# EasyEDA Pro project 起跑检测.epro

# Schematic Schematic1
Board Name: Board1; Create Date: 2025-03-22; Page Name: P1; Project Name: （等待焊接）起跑检测（螺丝孔扩大）; Schematic Name: Schematic1; Update Date: 2025-04-04; Company: 嘉立创EDA; Page Size: A4; Version: V1.0
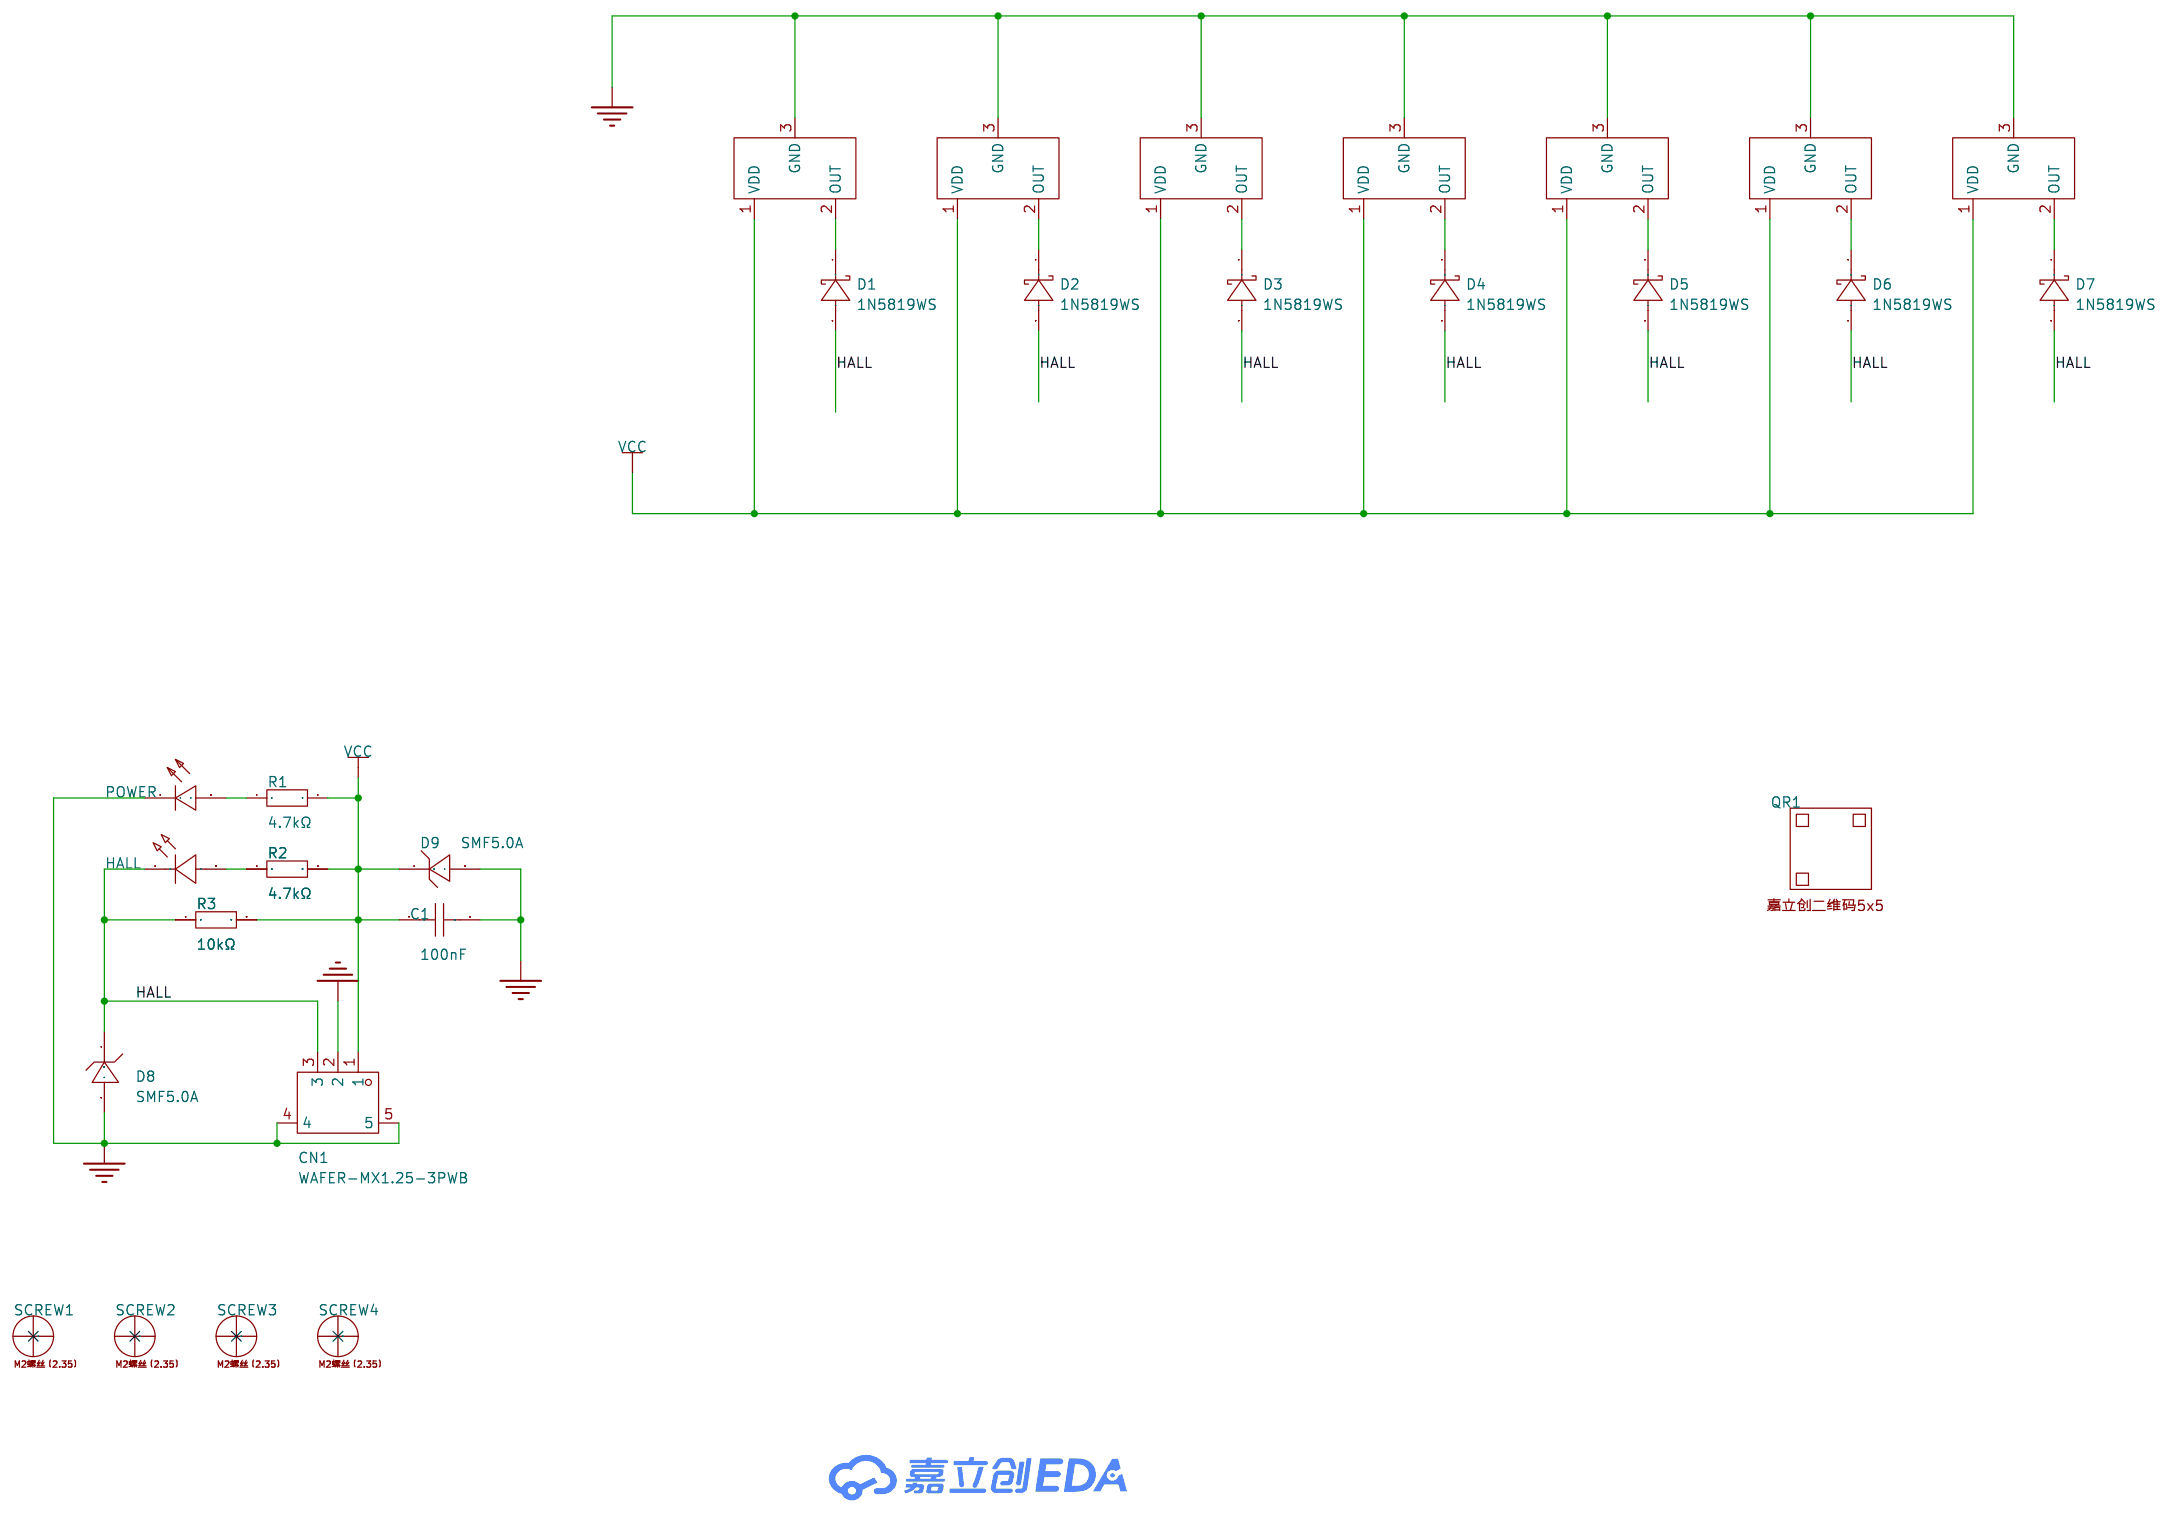
[diagram p0: schematic sheet]

## Parts
C1  100nF  [C0805]
CN1  WAFER-MX1.25-3PWB  [CONN-SMD_3P-P1.25_WAFER-MX1.25-3PWB]
D1  1N5819WS  [SOD-323_L1.6-W1.3-LS2.6-RD-1]
D2  1N5819WS  [SOD-323_L1.6-W1.3-LS2.6-RD-1]
D3  1N5819WS  [SOD-323_L1.6-W1.3-LS2.6-RD-1]
D4  1N5819WS  [SOD-323_L1.6-W1.3-LS2.6-RD-1]
D5  1N5819WS  [SOD-323_L1.6-W1.3-LS2.6-RD-1]
D6  1N5819WS  [SOD-323_L1.6-W1.3-LS2.6-RD-1]
D7  1N5819WS  [SOD-323_L1.6-W1.3-LS2.6-RD-1]
D8  SMF5.0A  [SOD-123FL_L2.7-W1.8-LS3.8-RD]
D9  SMF5.0A  [SOD-123FL_L2.7-W1.8-LS3.8-RD]
HALL  XL-2012SYGC  [LED0805-RD_GREEN]
POWER  NCD0603R1  [LED0603-RD_RED]
QR1  -  [JLC-QRCODE-5x5]
R1  4.7kΩ  [R0805]
R2  4.7kΩ  [R0805]
R3  10kΩ  [R0805]
SCREW1  -  [M2螺丝（2.35）]
SCREW2  -  [M2螺丝（2.35）]
SCREW3  -  [M2螺丝（2.35）]
SCREW4  -  [M2螺丝（2.35）]
U1  -  [SOT-23_L2.9-W1.3-P0.95-LS2.4-TL]
U2  -  [SOT-23_L2.9-W1.3-P0.95-LS2.4-TL]
U3  -  [SOT-23_L2.9-W1.3-P0.95-LS2.4-TL]
U4  -  [SOT-23_L2.9-W1.3-P0.95-LS2.4-TL]
U5  -  [SOT-23_L2.9-W1.3-P0.95-LS2.4-TL]
U6  -  [SOT-23_L2.9-W1.3-P0.95-LS2.4-TL]
U7  -  [SOT-23_L2.9-W1.3-P0.95-LS2.4-TL]

## Library data of the parts
C1 = CC0805KRX7R9BB104: 容值:100nF;精度:±10%;额定电压:50V;材质(温度系数):X7R;; LCSC Part Name: 100nF ±10% 50V; Supplier Part: C49678; Manufacturer: YAGEO(国巨); Supplier Footprint: 0805; JLCPCB Part Class: Basic Part; Datasheet: https://atta.szlcsc.com/upload/public/pdf/source/20180224/C181747_15194369449651363981.pdf; Supplier: LCSC; Tolerance: ±10%; Voltage Rated: 50V; Temperature Coefficient: X7R
CN1 = WAFER-MX1.25-3PWB: 插针结构:1x3P;间距:1.25mm;安装方式:卧贴;参考系列:PicoBlade(MX 1.25);总PIN数:3P;排数:1;每排PIN数:3;行距:-;额定电流:1A;触头材质:黄铜;触头镀层:-;工作温度:-25℃~+85℃;; LCSC Part Name: 1x3P 间距:1.25mm 卧贴 系列:PicoBlade(MX 1.25); Supplier Part: C3029360; Manufacturer: XUNPU(讯普); Supplier Footprint: SMD,P=1.25mm,卧贴; JLCPCB Part Class: 扩展库; Datasheet: https://atta.szlcsc.com/upload/public/pdf/source/20220527/5ACBB683E384B6AD06743F272F933620.pdf; Supplier: LCSC; Pins Structure: 1x3P; Pitch: 1.25mm; Mounting Type: 卧贴; Reference Series: PicoBlade(MX 1.25); Number of Pins: 3P; Number of Rows: 1; Number of PINs Per Row: 3; Current Rating: 1A; Contact Material: 黄铜; Operating Temperature: -25℃~+85℃; Voltage Rating: 125V; Plastic Material: LCP; Supplementary Features: 辅助焊脚; Color: 米色; Z-Height of the Board: 3.6mm; X-Length of Bottom Edge on Board (Spacing Line): 8.75mm; Y-Width of Bottom Edge on Board: 5.25mm
D1-D7 = 1N5819WS: 正向压降(Vf):580mV@1A;直流反向耐压(Vr):40V;整流电流:1A;; LCSC Part Name: 电压:40V 电流:1A; Supplier Part: C2903903; Manufacturer: GOODWORK(固得沃克); Supplier Footprint: SOD-323; JLCPCB Part Class: Extended Part; Datasheet: https://atta.szlcsc.com/upload/public/pdf/source/20220114/BF6ECC8ED918A91A4FEA6F25B6F03A5F.pdf; Supplier: LCSC; Forward Voltage (Vf@If): 580mV@1A; Reverse Voltage (Vr): 40V; Rectified Current: 1A; Reverse Leakage Current (Ir): 50uA@40V
D8 D9 = SMF5.0A_C193402: 反向截止电压(Vrwm):5V;最大钳位电压:9.2V;峰值脉冲电流(Ipp)@10/1000us:21.7A;击穿电压:6.4V;; LCSC Part Name: 单向TVS 5V截止 21.7A峰值脉冲; Supplier Part: C193402; Manufacturer: MDD; Supplier Footprint: SOD-123FL; JLCPCB Part Class: Extended Part; Datasheet: https://atta.szlcsc.com/upload/public/pdf/source/20230823/46DC63B2A09D9D06F4FC5ACC8B9FF97C.pdf; Supplier: LCSC; Reverse Stand-Off Voltage (Vrwm): 5V; Maximum Clamping Voltage: 9.2V; Peak Pulse Current (Ipp)@10/1000us: 21.7A; Breakdown Voltage: 6.4V; Type: TVS
HALL = XL-2012SYGC: 发光颜色:黄绿色;正向电压(VF):2.3V;功率:50mW;正向电流:20mA;主波长:565nm~575nm;透镜颜色:无色透明透镜;色温:-;发光强度:215mcd;发光角度:120°;载带方式:正贴;工作温度:-20℃~+85℃;; Supplier Part: C965816; Manufacturer: XINGLIGHT(成兴光); Supplier Footprint: 0805; JLCPCB Part Class: 扩展库; Datasheet: https://atta.szlcsc.com/upload/public/pdf/source/20240218/33A7A1C9B7559875425299FF3D6B2704.pdf; Supplier: LCSC; Emitted Color: 黄绿色; Forward Voltage (VF): 2.3V; Power Dissipation: 50mW; Forward Current: 20mA; Dominant Wavelength: 565nm~575nm; Peak Wavelength: 570nm; Lens Color: 无色透明透镜; Luminous Intensity: 215mcd; Viewing Angle: 120°; Mounting Sytle: 正贴; Operating Temperature: -20℃~+85℃
POWER = NCD0603R1_C84263: 灯头类型:-;发光颜色:红色;正向压降(Vf):1.6V~2.6V;功率:65mW;正向电流:25mA;波长:615nm~630nm;二极管配置:独立二极管;透镜颜色:-;色温:-;发光强度:80mcd~220mcd;发光角度:130°;载带方式:-;工作温度:-30℃~+85℃;; Supplier Part: C84263; Manufacturer: 国星光电; Supplier Footprint: 0603; JLCPCB Part Class: Extended Part; Datasheet: https://atta.szlcsc.com/upload/public/pdf/source/20200820/C84263_DABC6A75E58F576973B407FDBA283D60.pdf; Supplier: LCSC; Illumination Color: 红色; Voltage - Forward(Vf): 1.6V~2.6V; Power(Watts): 65mW; Forward Current: 25mA; Wavelength - Dominant: 615nm~630nm; Diode Configuration: 独立二极管; Luminous Intensity: 80mcd~220mcd; Viewing Angle: 130°; Operating Temperature: -30℃~+85℃
QR1 = 嘉立创二维码5x5: Check: false
R1 R2 = 0805W8F4701T5E: 电阻类型:厚膜电阻;阻值:4.7kΩ;精度:±1%;功率:125mW;最大工作电压:150V;温度系数:±100ppm/℃;; LCSC Part Name: 4.7kΩ ±1% 125mW 厚膜电阻; Supplier Part: C17673; Manufacturer: UNI-ROYAL(厚声); Supplier Footprint: 0805; JLCPCB Part Class: Basic Part; Datasheet: https://atta.szlcsc.com/upload/public/pdf/source/20200306/C422600_1E6D84923E4A46A82E41ADD87F860B5C.pdf; Supplier: LCSC; Type: 厚膜电阻; Tolerance: ±1%; Power(Watts): 125mW; Overload Voltage (Max): 150V; Temperature Coefficient: ±100ppm/℃; Operating Temperature Range: -55℃~+155℃
R3 = 0805W8F1002T5E_C17414: 电阻类型:厚膜电阻;阻值:10kΩ;精度:±1%;功率:125mW;最大工作电压:150V;温度系数:±100ppm/℃;; LCSC Part Name: 10kΩ ±1% 125mW 厚膜电阻; Supplier Part: C17414; Manufacturer: UNI-ROYAL(厚声); Manufacturer Part: 0805W8F1002T5E; Supplier Footprint: 0805; JLCPCB Part Class: Basic Part; Datasheet: https://atta.szlcsc.com/upload/public/pdf/source/20200306/C422600_1E6D84923E4A46A82E41ADD87F860B5C.pdf; Supplier: LCSC; Type: 厚膜电阻; Tolerance: ±1%; Power(Watts): 125mW; Overload Voltage (Max): 150V; Temperature Coefficient: ±100ppm/℃; Operating Temperature Range: -55℃~+155℃
SCREW1-SCREW4 = M2螺丝（2.35）
U1-U7 = 霍尔DH553: Check: false

## Nets
GND: C1.2 CN1.2 CN1.4 CN1.5 D8.2(A) D9.2(A) POWER.1(K) U1.3(GND) U2.3(GND) U3.3(GND) U4.3(GND) U5.3(GND) U6.3(GND) U7.3(GND)
VCC: C1.1 CN1.1 D9.1(C) R1.2 R2.2 R3.2 U1.1(VDD) U2.1(VDD) U3.1(VDD) U4.1(VDD) U5.1(VDD) U6.1(VDD) U7.1(VDD)
HALL: CN1.3 D1.2(A) D2.2(A) D3.2(A) D4.2(A) D5.2(A) D6.2(A) D7.2(A) D8.1(C) HALL.1(K) R3.1
$1N1402: D1.1(K) U1.2(OUT)
$1N1406: D2.1(K) U2.2(OUT)
$1N1411: D3.1(K) U3.2(OUT)
$1N1416: D4.1(K) U4.2(OUT)
$1N1421: D5.1(K) U5.2(OUT)
$1N1426: D6.1(K) U6.2(OUT)
$1N1431: D7.1(K) U7.2(OUT)
$1N2064: POWER.2(A) R1.1
$1N2068: HALL.2(A) R2.1

Not connected (* = marked no-connect by the designer): SCREW1 1*; SCREW2 1*; SCREW3 1*; SCREW4 1*

# Board PCB1
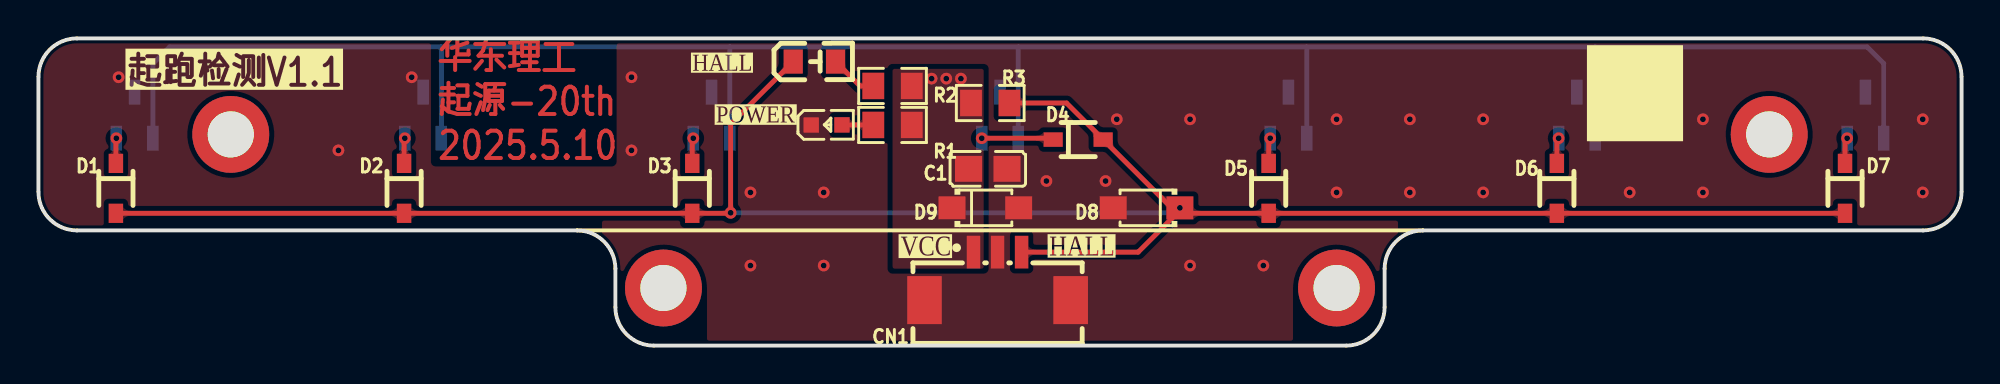
[diagram p1: board, top side]
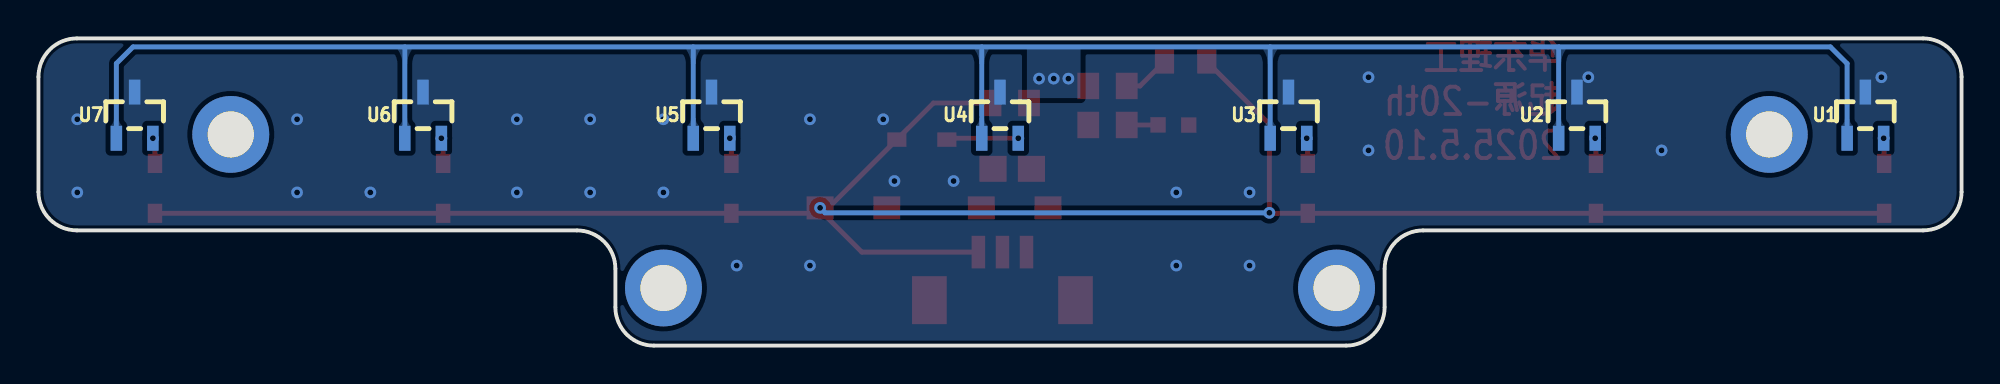
[diagram p2: board, bottom side, seen from below]

Outline 100 x 16 mm; copper layers: Top Layer, Bottom Layer. Coordinates in mm from the lower left corner of the outline.
Outline path: 0,14 0,8 arc(0.59,6.59) 2,6 28,6 arc(29.41,5.41) 30,4 30,2 arc(30.59,0.59) 32,0 68,0 arc(69.41,0.59) 70,2 70,4 arc(70.59,5.41) 72,6 98,6 arc(99.41,6.59) 100,8 100,14 arc(99.41,15.41) 98,16 2,16 arc(0.59,15.41) 0,14
Stack: Top Layer 0.035mm / Dielectric1 1.51mm FR4 er 4.5 / Bottom Layer 0.035mm

## Design rules (mm)
template: xyf_v1.1
spacing copperThickness1oz (default): track to track 0.102, other pairs 0.152 to 0.3
spacing copperThickness2oz: track to track 0.203, other pairs 0.152 to 0.3
spacing 0焊盘板框间距: track to track 0.152, other pairs 0 to 0.3
spacing copperThicknessInner0.5oz: track to track 0.089, other pairs 0.152 to 0.3
track width copperThickness1oz (default): min 0.127, default 0.254, max 2.54
track width copperThickness2oz: min 0.203, default 0.254, max 2.54
track width copperThickness0.5oz: min 0.089, default 0.254, max 2.54
differential pair differentialPair (default): width min 0.127, default 0.254, max 2.54; gap min 0.152, default 0.152
via viaSize (default): diameter min 0.5, default 0.61, max 10; hole min 0.3, default 0.305, max 6.3
via viaSize2: diameter min 0.5, default 0.61, max 10; hole min 0.3, default 0.305, max 6.299
via viaSize4: diameter min 0.45, default 0.61, max 10; hole min 0.3, default 0.305, max 6.299

## Placement (name value [footprint] x y rotation side)
C1  100nF  [C0805]  49.37 9.21 0 top
CN1  WAFER-MX1.25-3PWB  [CONN-SMD_3P-P1.25_WAFER-MX1.25-3PWB]  49.87 3.62 0 top
D1  1N5819WS  [SOD-323_L1.6-W1.3-LS2.6-RD-1]  4.03 8.19 270 top
D2  1N5819WS  [SOD-323_L1.6-W1.3-LS2.6-RD-1]  19.01 8.19 270 top
D3  1N5819WS  [SOD-323_L1.6-W1.3-LS2.6-RD-1]  34 8.19 270 top
D4  1N5819WS  [SOD-323_L1.6-W1.3-LS2.6-RD-1]  54.06 10.73 0 top
D5  1N5819WS  [SOD-323_L1.6-W1.3-LS2.6-RD-1]  63.97 8.19 270 top
D6  1N5819WS  [SOD-323_L1.6-W1.3-LS2.6-RD-1]  78.96 8.19 270 top
D7  1N5819WS  [SOD-323_L1.6-W1.3-LS2.6-RD-1]  93.94 8.19 270 top
D8  SMF5.0A  [SOD-123FL_L2.7-W1.8-LS3.8-RD]  57.62 7.17 180 top
D9  SMF5.0A  [SOD-123FL_L2.7-W1.8-LS3.8-RD]  49.24 7.17 0 top
HALL  XL-2012SYGC  [LED0805-RD_GREEN]  40.35 14.79 0 top
POWER  NCD0603R1  [LED0603-RD_RED]  40.98 11.49 0 top
QR1  -  [JLC-QRCODE-5x5]  83.02 13.14 0 top
R1  4.7kΩ  [R0805]  44.41 11.49 0 top
R2  4.7kΩ  [R0805]  44.41 13.52 0 top
R3  10kΩ  [R0805]  49.49 12.64 180 top
SCREW1  -  [M2螺丝（2.35）]  32.5 3 0 top
SCREW2  -  [M2螺丝（2.35）]  67.5 3 0 top
SCREW3  -  [M2螺丝（2.35）]  10 11 0 top
SCREW4  -  [M2螺丝（2.35）]  90 11 0 top
U1  -  [SOT-23_L2.9-W1.3-P0.95-LS2.4-TL]  5 12 90 bottom
U2  -  [SOT-23_L2.9-W1.3-P0.95-LS2.4-TL]  20 12 90 bottom
U3  -  [SOT-23_L2.9-W1.3-P0.95-LS2.4-TL]  35 12 90 bottom
U4  -  [SOT-23_L2.9-W1.3-P0.95-LS2.4-TL]  50 12 90 bottom
U5  -  [SOT-23_L2.9-W1.3-P0.95-LS2.4-TL]  65 12 90 bottom
U6  -  [SOT-23_L2.9-W1.3-P0.95-LS2.4-TL]  80 12 90 bottom
U7  -  [SOT-23_L2.9-W1.3-P0.95-LS2.4-TL]  95 12 90 bottom

## Footprints (pads in the part's own frame, mm; a bottom-side part is the same pattern mirrored in y, then rotated)
C0805
  rect 1.41x1.35 smd: 1(-1,0) 2(1,0)
CONN-SMD_3P-P1.25_WAFER-MX1.25-3PWB
  rect 0.7x1.7 smd: 1(-1.25,1.25) 2(0,1.25) 3(1.25,1.25)
  rect 1.8x2.5 smd: 4(-3.8,-1.25) 5(3.8,-1.25)
LED0603-RD_RED
  rect 0.8x0.8 smd: 1(-0.799,-0.004) 2(0.799,0.004)
LED0805-RD_GREEN
  rect 1x1.25 smd: 1(-1.1,0) 2(1.1,0)
M2螺丝（2.35）
  round 4 hole 2.4x2.35: 1(0,0)
R0805
  rect 1.133x1.377 smd: 1(-1,0) 2(1,0)
SOD-123FL_L2.7-W1.8-LS3.8-RD
  rect 1.4x1.2 smd: 1(-1.735,0) 2(1.735,0)
SOD-323_L1.6-W1.3-LS2.6-RD-1
  rect 1x0.75 smd: 1(-1.3,0) 2(1.3,0)
SOT-23_L2.9-W1.3-P0.95-LS2.4-TL
  rect 1.3x0.6 smd: 1(-1.2,0.95) 2(-1.2,-0.95) 3(1.2,0)

## Nets
As in the schematic.

Pads without a net: SCREW1 1; SCREW2 1; SCREW3 1; SCREW4 1

## Via types
v1: diameter 0.61, hole 0.305, Top Layer to Bottom Layer, 38 vias

## Routing (per net, layer and track width the routed paths; a pad name or vN(x,y) marks a point on that pad's centre or on a via; arc(x,y) is an arc through that point)
GND:
  vias: v1(4.17,13.98) v1(15.6,10.17) v1(19.41,13.98) v1(30.84,13.98) v1(30.84,10.17) v1(37.02,7.98) v1(37.02,4.17) v1(40.83,7.98) v1(40.83,4.17) v1(52.41,8.57) v1(55.49,8.57) v1(56.07,11.79) v1(59.88,11.79) v1(59.88,4.17) v1(63.69,4.17) v1(67.5,11.79) v1(67.5,7.98) v1(71.31,11.79) v1(71.31,7.98) v1(75.12,11.79) v1(75.12,7.98) v1(82.74,7.98) v1(86.55,11.79) v1(86.55,7.98) v1(97.98,11.79) v1(97.98,7.98)
VCC: length 122.3
  Bottom Layer w0.254: U1.1 5.95,14.69 6.82,15.56 20.95,15.56 ; 20.95,15.56 U2.1 ; 20.95,15.56 35.95,15.56 ; U4.1 50.95,15.56 ; 50.95,15.56 35.95,15.56 ; 50.95,15.56 65.95,15.56 ; 80.95,15.56 95.09,15.56 95.95,14.69 U7.1 ; 80.95,15.56 U6.1 ; 80.95,15.56 65.95,15.56 ; 35.95,15.56 U3.1 ; 65.95,15.56 U5.1
  vias: v1(46.44,13.91) v1(47.21,13.91) v1(47.97,13.91)
HALL: length 119.8
  Top Layer w0.254: R3.1 53.46,12.64 D4.2 58.92,7.17 v1(59.35,7.17) ; v1(59.35,7.17) 59.64,6.89 D5.2 D6.2 D7.2 ; v1(59.35,7.17) 59.35,7.04 57.18,4.87 CN1.3 ; D1.2 D2.2 D3.2 35.97,6.89 v1(35.99,6.92) 35.99,11.54 HALL.1
  Bottom Layer w0.254: v1(35.99,6.92) 59.1,6.92 v1(59.35,7.17)
$1N1402: length 1.3
  Top Layer w0.254: D1.1 4.03,10.78 v1(4.05,10.8)
$1N1406: length 1.3
  Top Layer w0.254: v1(19.05,10.8) 19.01,10.76 D2.1
$1N1411: length 1.3
  Top Layer w0.254: D3.1 34,10.75 v1(34.05,10.8)
$1N1416: length 3.8
  Top Layer w0.254: v1(49.05,10.8) 52.76,10.8 D4.1
$1N1421: length 1.3
  Top Layer w0.254: D5.1 63.97,10.72 v1(64.05,10.8)
$1N1426: length 1.3
  Top Layer w0.254: v1(79.05,10.8) 78.96,10.71 D6.1
$1N1431: length 1.4
  Top Layer w0.254: v1(94.05,10.8) 93.94,10.69 D7.1
$1N2064: length 1.6
  Top Layer w0.254: R1.1 41.79,11.49 POWER.2
$1N2068: length 2.5
  Top Layer w0.254: HALL.2 42.72,13.52 R2.1

## Copper pours and planes (outline as drawn; the poured copper is in the pictures)
GND on Top Layer: -3.09,21.02 106.26,21.02 106.26,-4.89 -3.09,-4.89
GND on Bottom Layer: -2.2,19.75 104.23,19.75 104.23,-2.86 -2.2,-2.86
VCC on Top Layer: 44.41,14.41 49.15,14.41 49.15,4.01 44.41,4.01
VCC on Bottom Layer: 45.81,15.68 48.6,15.68 48.6,12.89 45.81,12.89

Small or netless copper shapes (teardrops, artwork), in the pictures only: 39 on Top Layer, 14 on Bottom Layer

## Text on the board
Top Layer: 华东理工 / 起源-20th / 2025.5.10
Top Silkscreen Layer: VCC | HALL | 起跑检测V1.1
